# Altium schematic sheet X_TRACK_PWR V3.1.SchDoc
size 420 x 297 mm; PageSetup: Record=PageOptions|CenterHorizontal=False|CenterVertical=False|PrintScale=0.67|XCorrection=0.00|YCorrection=0.00|PrintKind=2|BorderSize=5000000|LeftOffset=0|BottomOffset=0|Orientation=2|PaperLength=2969|PaperWidth=2100|Scale=100|PaperSource=7|PrintQuality=600|MediaType=1|DitherType=10|PaperKind=A4 (210 x 297 мм)|PrintScaleMode=1
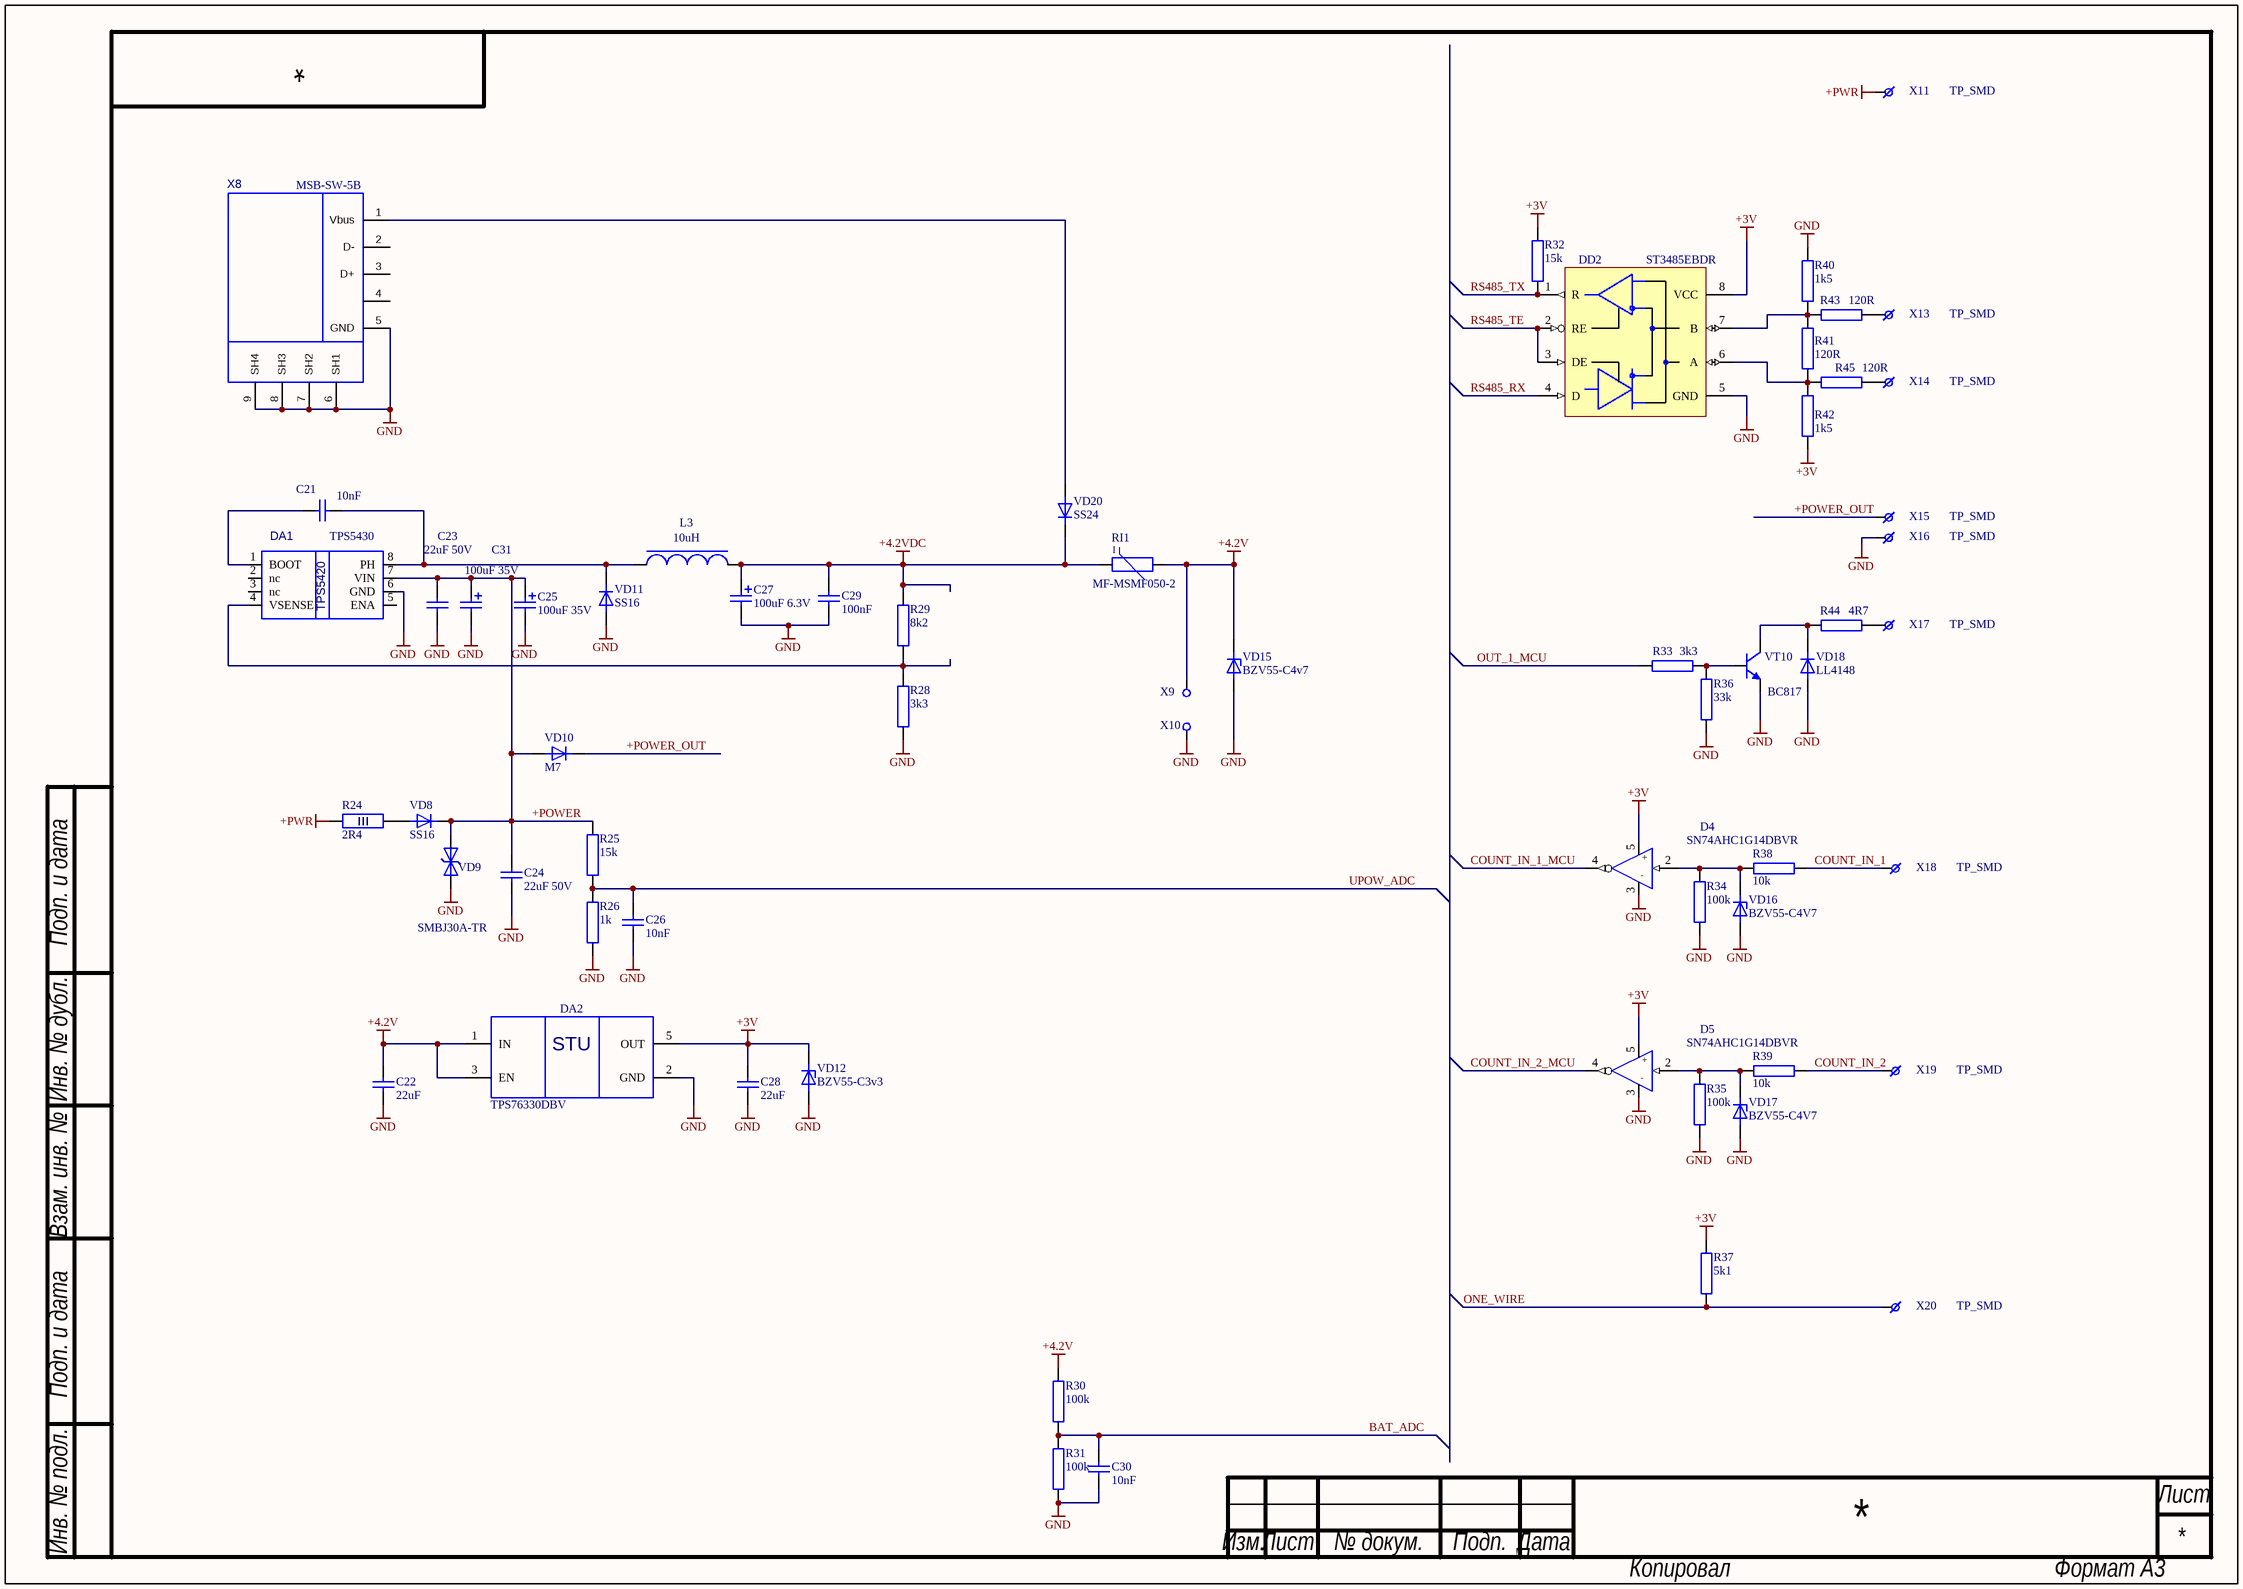
[diagram p0: X_TRACK_PWR V3.1.SchDoc]

## Parts
C21  value 10nF  [CC0603]  (hidden comment: CC0603_10nF)
C22  value 22uF  [CC0805]  (hidden comment: CC0805_10uF)
C23  value 22uF 50V  [CC1206]  (hidden comment: CC1206_10uF)
C24  value 22uF 50V  [CC1206]  (hidden comment: CC1206_10uF)
C25  value 100uF 35V  [CAPPR2.5-6.3X11.5 - HR]  (hidden comment: C_ECR_100uF 35V_(D6))
C26  value 10nF  [CC0603]  (hidden comment: CC0603_10nF)
C27  value 100uF 6.3V  [6032_TC]  (hidden comment: C_TAJ 100uF 6.3V C)
C28  value 22uF  [CC0805]  (hidden comment: CC0805_10uF)
C29  value 100nF  [CC0603]  (hidden comment: CC0603_100nF)
C30  value 10nF  [CC0603]  (hidden comment: CC0603_10nF)
C31  value 100uF 35V  [CAPPR2.5-6.3X11.5 - HL]  (hidden comment: C_ECR_100uF 35V_(D6))
D4  SN74AHC1G14DBVR  [SOT23-5AN]
D5  SN74AHC1G14DBVR  [SOT23-5AN]
DA1  value TPS5430  [SO8]  (hidden comment: TPS5420)
DA2  TPS76330DBV  [SOT23-5]
DD2  value ST3485EBDR  [8S1_L]  (hidden comment: SN75176)
L3  value 10uH  [CDRH6D38]  (hidden comment: CDRH6D38)
R24  value 2R4  [MFR300- 3W-23-17.5X6.5]  (hidden comment: R_MFR03W)
R25  value 15k  [RC0603]  (hidden comment: RC0603 15k)
R26  value 1k  [RC0603]  (hidden comment: RC0603 1k)
R28  value 3k3  [RC0603]  (hidden comment: RC0603 3k3)
R29  value 8k2  [RC0603]  (hidden comment: RC0603 8k2)
R30  value 100k  [RC0603]  (hidden comment: RC0603 100k)
R31  value 100k  [RC0603]  (hidden comment: RC0603 100k)
R32  value 15k  [RC0603]  (hidden comment: RC0603 15k)
R33  value 3k3  [RC0603]  (hidden comment: RC0603 3k3)
R34  value 100k  [RC0603]  (hidden comment: RC0603 100k)
R35  value 100k  [RC0603]  (hidden comment: RC0603 100k)
R36  value 33k  [RC0603]  (hidden comment: RC0603 33k)
R37  value 5k1  [RC0603]  (hidden comment: RC0603 5k1)
R38  value 10k  [RC0603]  (hidden comment: RC0603 4k7)
R39  value 10k  [RC0603]  (hidden comment: RC0603 4k7)
R40  value 1k5  [RC0603]  (hidden comment: RC0603 1k5)
R41  value 120R  [RC0603]  (hidden comment: RC0603 120R)
R42  value 1k5  [RC0603]  (hidden comment: RC0603 1k5)
R43  value 120R  [RC0603]  (hidden comment: RC0603 120R)
R44  value 4R7  [RC0603]  (hidden comment: RC0603 10R)
R45  value 120R  [RC0603]  (hidden comment: RC0603 120R)
RI1  value MF-MSMF050-2  [FSMD1812 Series]  (hidden comment: POLY_PTS)
VD8  value SS16  [SMA/DO-214AC]  (hidden comment: M7)
VD9  value SMBJ30A-TR  [SMB/DO-214AA]  (hidden comment: Suppressor)
VD10  M7  [SMA/DO-214AC]
VD11  value SS16  [SMB/DO-214AA]  (hidden comment: SS24)
VD12  value BZV55-C3v3  [SOD80D_C]  (hidden comment: Zener)
VD15  value BZV55-C4v7  [SOD80D_C]  (hidden comment: Zener)
VD16  value BZV55-C4V7  [SOD80D_C]  (hidden comment: Zener)
VD17  value BZV55-C4V7  [SOD80D_C]  (hidden comment: Zener)
VD18  LL4148  [SOD80D_C]
VD20  SS24  [SMB/DO-214AA]
VT10  BC817  [SOT23]
X8  MSB-SW-5B  [MSB-SW-5B]
X9  Con 1  [TP_1/2]  (value not drawn)
X10  Con 1  [TP_1/2]  (value not drawn)
X11  value TP_SMD  [TP_1.5/2.5]  (hidden comment: Con_1)
X13  value TP_SMD  [TP_1/2]  (hidden comment: Con_1)
X14  value TP_SMD  [TP_1/2]  (hidden comment: Con_1)
X15  value TP_SMD  [TP_1/2]  (hidden comment: Con_1)
X16  value TP_SMD  [TP_1/2]  (hidden comment: Con_1)
X17  value TP_SMD  [TP_1/2]  (hidden comment: Con_1)
X18  value TP_SMD  [TP_1/2]  (hidden comment: Con_1)
X19  value TP_SMD  [TP_1/2]  (hidden comment: Con_1)
X20  value TP_SMD  [TP_1/2]  (hidden comment: Con_1)

## Nets
+3V: C28.2 D4.5(+V) D5.5(+V) DA2.5(OUT) DD2.8(VCC) R32.2 R37.2 R42.1 VD12.2(K)
+4.2V: C22.2 DA2.1(IN) DA2.3(EN) R30.2 RI1.1 VD15.2(K) X9.1
+4.2VDC: C27.1 C29.1 L3.2 R29.2 RI1.2 VD20.2(K)
+PWR: R24.1 X11.1
GND: C22.1 C23.1 C24.1 C25.2 C26.1 C27.2 C28.1 C29.2 C30.1 C31.2 D4.3(GND) D5.3(GND) DA1.6(GND) DA2.2(GND) DD2.5(GND) R26.1 R28.1 R31.1 R34.1 R35.1 R36.1 R40.2 VD9.1(A) VD11.1(A) VD12.1(A) VD15.1(A) VD16.1(A) VD17.1(A) VD18.1(A) VT10.2(E) X8.5(GND) X8.6(SH1) X8.7(SH2) X8.8(SH3) X8.9(SH4) X10.1 X16.1
+POWER: C23.2 C24.2 C25.1 C31.1 DA1.7(VIN) R25.2 VD8.2(K) VD9.2(K) VD10.1(A)
+POWER_OUT: VD10.2(K) X15.1
BAT_ADC: C30.2 R30.1 R31.2
COUNT_IN_1: R38.1 X18.1
COUNT_IN_1_MCU: D4.4(Y)
COUNT_IN_2: R39.1 X19.1
COUNT_IN_2_MCU: D5.4(Y)
ONE_WIRE: R37.1 X20.1
OUT_1_MCU: R33.1
RS485_RX: DD2.4(D)
RS485_TE: DD2.2(RE) DD2.3(DE)
RS485_TX: DD2.1(R) R32.1
UPOW_ADC: C26.2 R25.1 R26.2
NetC21_1: C21.1 DA1.1(BOOT)
NetC21_2: C21.2 DA1.8(PH) L3.1 VD11.2(K)
NetD4_2: D4.2(A) R34.2 R38.2 VD16.2(K)
NetD5_2: D5.2(A) R35.2 R39.2 VD17.2(K)
NetDA1_4: DA1.4(VSENSE) R28.2 R29.1
NetDD2_6: DD2.6(A) R41.1 R42.2 R45.2
NetDD2_7: DD2.7(B) R40.1 R41.2 R43.2
NetR24_2: R24.2 VD8.1(A)
NetR33_2: R33.2 R36.2 VT10.1(B)
NetR43_1: R43.1 X13.1
NetR44_1: R44.1 X17.1
NetR44_2: R44.2 VD18.2(K) VT10.3(C)
NetR45_1: R45.1 X14.1
NetVD20_1: VD20.1(A) X8.1(Vbus)

Not connected (* = marked no-connect by the designer): DA1 2(nc) 3(nc) 5(ENA); DA2 4; X8 2(D-) 3(D+) 4

## Notes on the sheet
- Подп. и дата
- Инв. № дубл.
- Взам. инв. №
- Инв. № подл.
- Лист
- Изм.
- № докум.
- Подп.
- Дата
- Копировал
- Формат А3
- (in symbol FSMD110-16) I
- (in symbol SN74AHC1G14DBVR) +; -
- (in symbol TPS76330DBV) STU

## Library data of the parts
C21 C26 C30 = CC0603_10nF: Capacitor SMD 0603 X7R 10nF 20% 50V; Manufacturer: Hitano; Manufacturer p/n: 0603B103M500N3; Package: 0603
C22 C28 = CC0805_10uF: Capacitor SMD 0805 Y5V 10uF 20% 16V; Manufacturer: Hitano; Manufacturer p/n: 0805Y106Z160N3; Package: 0805
C23 C24 = CC1206_10uF: Capacitor SMD 1206 X5R 10uF 20% 50V; Manufacturer: Hitano; Manufacturer p/n: 1206X106M500NT; Package: 1206
C25 C31 = C_ECR_100uF 35V_(D6): Standard Capacitor polarized Radial leads, cylindrical aluminum case,; Manufacturer: Hitano; Manufacturer p/n: ECR101M35BA; Package: 2.5x6x11(PinSpac.*Dia*H)
C27 = C_TAJ 100uF 6.3V C: Capacitor tantall; Manufacturer: AVX; Manufacturer p/n: TAJC107M006RNJ; Package: case C
C29 = CC0603_100nF: Capacitor SMD 0603 X7R 100nF 20% 50V; Manufacturer: Hitano; Manufacturer p/n: 0603B104M500N3; Package: 0603
D4 D5 = SN74AHC1G14DBVR: SINGLE  SCHMITT-TRIGGER  INVERTER  GATE; Manufacturer: Texas  Instruments; Package: SOT23-5; Value: SN74AHC1G14DBVR
DA2 = TPS76330DBV: RefDes2: {RefDes2}; Value: TPS76330DBV
DD2 = SN75176: DRIVER RS-422/DIFFERENTIAL DRIVER AND RECEIVER PAIR
R24 = R_MFR03W: Resistor  axial 3W; Manufacturer: Uni-ohm; Package: 3W
R25 R32 = RC0603 15k: Resistor  SMD RC0603 5% 15k; Manufacturer: Hitano; Manufacturer p/n: Hitano RC0603JR7-15k; Package: RC0603
R26 = RC0603 1k: Resistor  SMD 0603  5% 1k; Manufacturer: Hitano; Manufacturer p/n: Hitano RC0603JR7-1k; Package: RC0603
R28 R33 = RC0603 3k3: Resistor  SMD 0603  5% 3k3; Manufacturer: Hitano; Manufacturer p/n: Hitano RC0603JR7-3k3; Package: RC0603
R29 = RC0603 8k2: Resistor  SMD 0603  5% 8k2; Manufacturer: Hitano; Manufacturer p/n: Hitano RC0603JR7- 8k2; Package: RC0603
R30 R31 R34 R35 = RC0603 100k: Resistor  SMD 0603 5% 100k; Manufacturer: Hitano; Manufacturer p/n: Hitano RC0603JR7-100k; Package: RC0603
R36 = RC0603 33k: Resistor  SMD 0603 5% 33k; Manufacturer: Hitano; Manufacturer p/n: Hitano RC0603JR7-33k; Package: RC0603
R37 = RC0603 5k1: Resistor  SMD 0603 5% 5k1; Manufacturer: Hitano; Manufacturer p/n: Hitano RC0603JR7-5k1; Package: RC0603
R38 R39 = RC0603 4k7: Resistor  SMD 0603 5% 4k7; Manufacturer: Hitano; Manufacturer p/n: Hitano RC0603JR7-4k7; Package: RC0603
R40 R42 = RC0603 1k5: Resistor  SMD 0603  5% 1k5; Manufacturer: Hitano; Manufacturer p/n: Hitano RC0603JR7-1k5; Package: RC0603
R41 R43 R45 = RC0603 120R: Resistor  SMD 0603 5% 120R; Manufacturer: Hitano; Manufacturer p/n: Hitano RC0603JR7-120R; Package: RC0603
R44 = RC0603 10R: Resistor  SMD 0603 5% 10R; Manufacturer: Hitano; Manufacturer p/n: Hitano RC0603JR7-10R; Package: RC0603
RI1 = FSMD110-16: Polymeric PTC resettable fuses; Manufacturer: Fuzetech; Package: 1812
VD8 VD10 = M7: SURFACE MOUNT GENERAL RECTIFIER; Manufacturer: Suntan Technology Company Limited; Package: DO-214AC(SMA)
  VD10: Value: M7
VD9 = Suppressor: TRANSIENT VOLTAGE SUPPRESSORS
VD11 VD20 = SS24: SMD Diod 2A 40V; Manufacturer: Vishay Semiconductors; Package: DO-214AA (SMB)
  VD20: Value: SS24
VD12 VD15-VD17 = Zener: Zener diode; Manufacturer: Philips; Package: SOD80
VD18 = LL4148: SMD Diod LL4148; Manufacturer: Fairchild Semiconductor; Package: SOD80; Value: LL4148
VT10 = BC817: NPN general-purpose transistors, 45V, 500mA; Manufacturer: Philips; Manufacturer p/n: BC817; Package: SOT23-3; Value: BC817
X9 X10 = Con 1: Contact; Value: TP_SMD
X11 X13-X20 = Con_1: Contact
X8 = MSB-SW-5B: Value: MSB-SW-5B